# EAGLE design Mainboard (EAGLE 9.2.2)
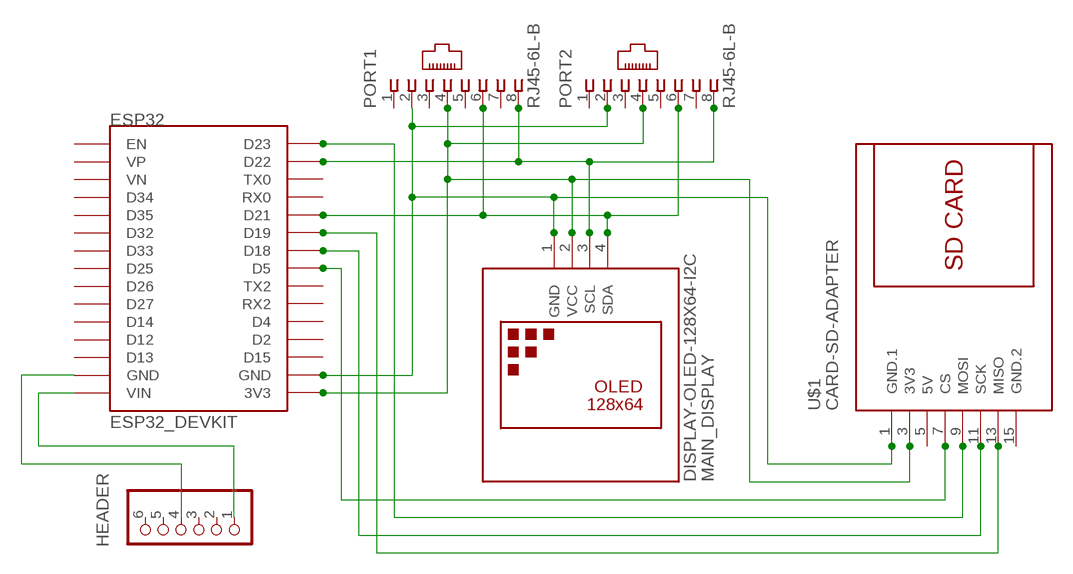
[diagram p0: schematic, sheet 1]

## Parts
ESP32  ESP32_DEVKIT  [ESP32_DEVKIT]
HEADER  PINHD-1X6CLEAN  [1X06-CLEAN]
MAIN_DISPLAY  DISPLAY-OLED-128X64-I2C  [DISPLAY-OLED-128X64-I2C]
PORT1  RJ45-6L-B  [RJ45-NO-SHIELD]
PORT2  RJ45-6L-B  [RJ45-NO-SHIELD]
U$1  CARD-SD-ADAPTER  [CARD-SD-ADAPTER]

## Nets
N$1: ESP32.D21 MAIN_DISPLAY.4(SDA) PORT1.6 PORT2.6
N$2: ESP32.D23 U$1.9(MOSI)
N$3: ESP32.D22 MAIN_DISPLAY.3(SCL) PORT1.8 PORT2.8
N$4: ESP32.D18 U$1.11(SCK)
N$5: ESP32.D5 U$1.7(CS)
N$6: ESP32.D19 U$1.13(MISO)
N$7: ESP32.GND@2(GND) MAIN_DISPLAY.1(GND) PORT1.2 PORT2.2 U$1.1(GND.1)
N$8: ESP32.VIN HEADER.1
N$9: ESP32.3V3 MAIN_DISPLAY.2(VCC) PORT1.4 PORT2.4 U$1.3(3V3)
N$10: ESP32.GND@1(GND) HEADER.4
Unconnected: ESP32.D2 ESP32.D4 ESP32.D12 ESP32.D13 ESP32.D14 ESP32.D15 ESP32.D25 ESP32.D26 ESP32.D27 ESP32.D32 ESP32.D33 ESP32.D34 ESP32.D35 ESP32.EN ESP32.RX0 ESP32.RX2 ESP32.TX0 ESP32.TX2 ESP32.VN ESP32.VP HEADER.2 HEADER.3 HEADER.5 HEADER.6 PORT1.1 PORT1.3 PORT1.5 PORT1.7 PORT2.1 PORT2.3 PORT2.5 PORT2.7

## Power pins joined to a net without a drawn wire
5V: U$1.5(5V)
GND.2: U$1.15(GND.2)

## Library data of the parts
ESP32 = DOIT_ESP32_DEVKIT:ESP32_DEVKIT: ESP32 DEVKIT BOARD
HEADER = adafruit:PINHD-1X6: PIN HEADER
MAIN_DISPLAY = diy-modules:DISPLAY-OLED-128X64-I2C: 128x64 Dot Matrix OLED Module based on SSD1306 chip Variant with I2C interface More details available here: http://www.instructables.com/id/Monochrome-096-i2c-OLED-display-with-arduino-SSD13/ SSD1306 datasheet: https://cdn-shop.adafruit.com/datasheets/SSD1306.pdf Click here to find device on ebay.com <http://www.ebay.com/sch/oled+display+128x64+iic> Note: There are two variants: I2C and SPI. Search for the proper version.
PORT1 = con-tycoelectronics:RJ45: CORCOM Modular RJ Jacks No Shield Source: www.tycoelectronics.com .. ENG_DS_1654001_1099_RJ_L_0507.pdf; MPN: RJ45-6L-B; OC_FARNELL: unknown; OC_NEWARK: 16R6090; SPICEPREFIX: X
PORT2 = con-tycoelectronics:RJ45: CORCOM Modular RJ Jacks No Shield Source: www.tycoelectronics.com .. ENG_DS_1654001_1099_RJ_L_0507.pdf; MPN: RJ45-6L-B; OC_FARNELL: unknown; OC_NEWARK: 16R6090
U$1 = diy-modules:CARD-SD-ADAPTER: Full Size SD Card Adapter Module with onboard 3.3V regulator Guide describing how to use SD card with Arduino is available here: https://www.arduino.cc/en/Reference/SDCardNotes Click here to find device on ebay.com <http://www.ebay.com/sch/sd+card+socket+module>

## Board
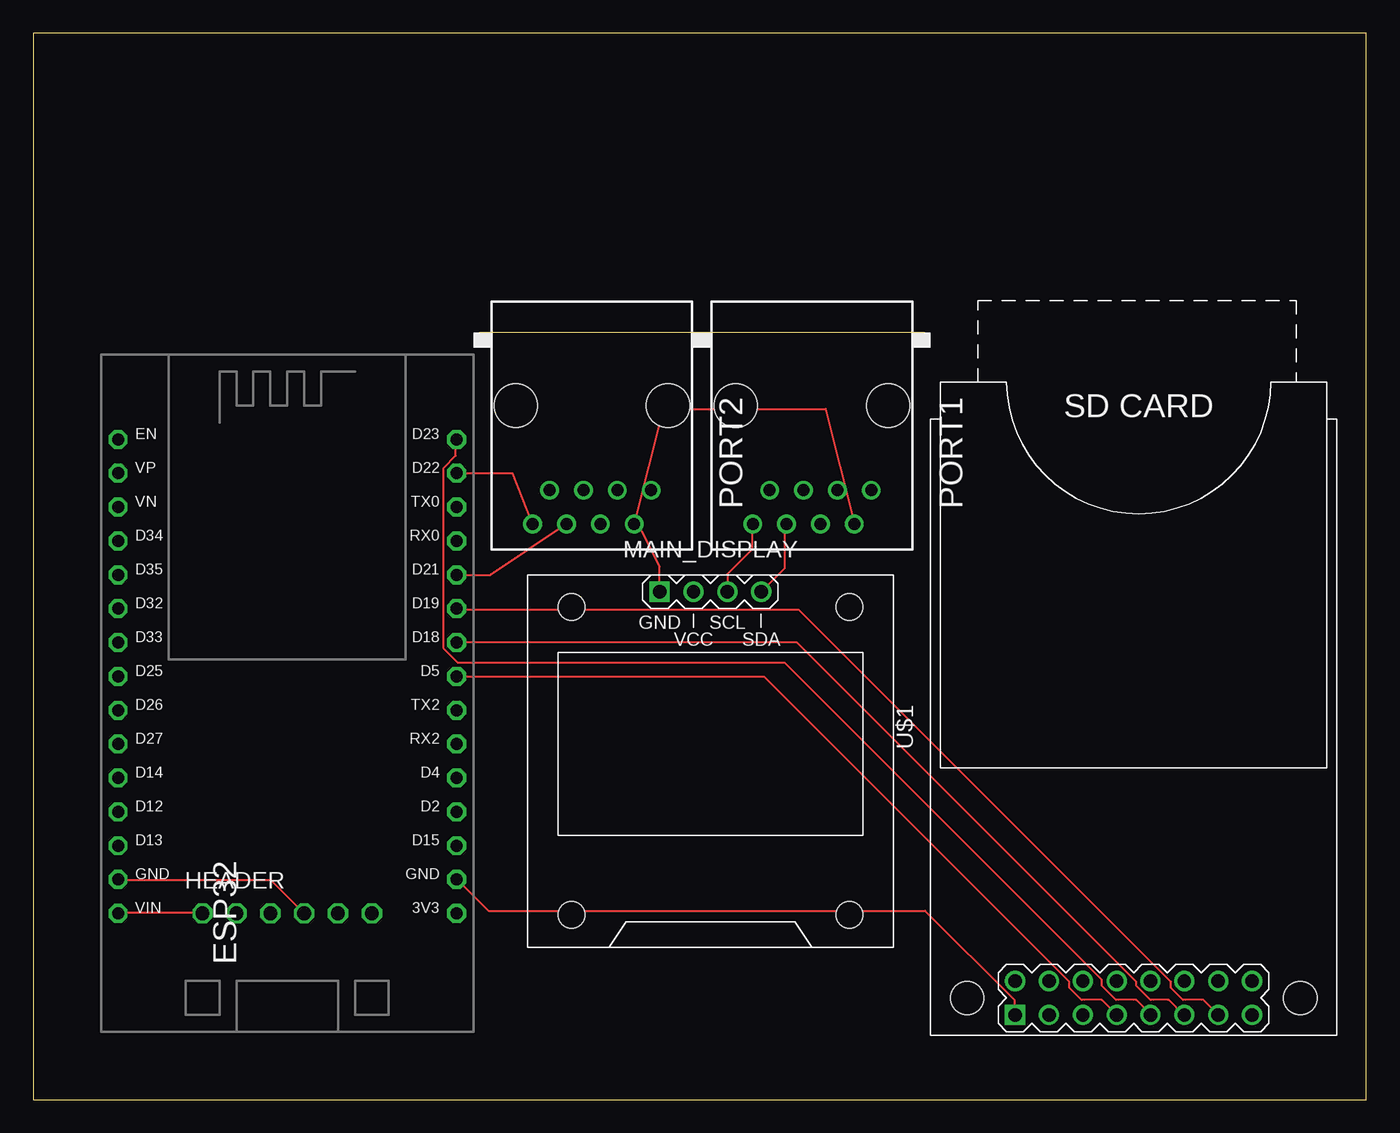
[diagram p1: board, top side]
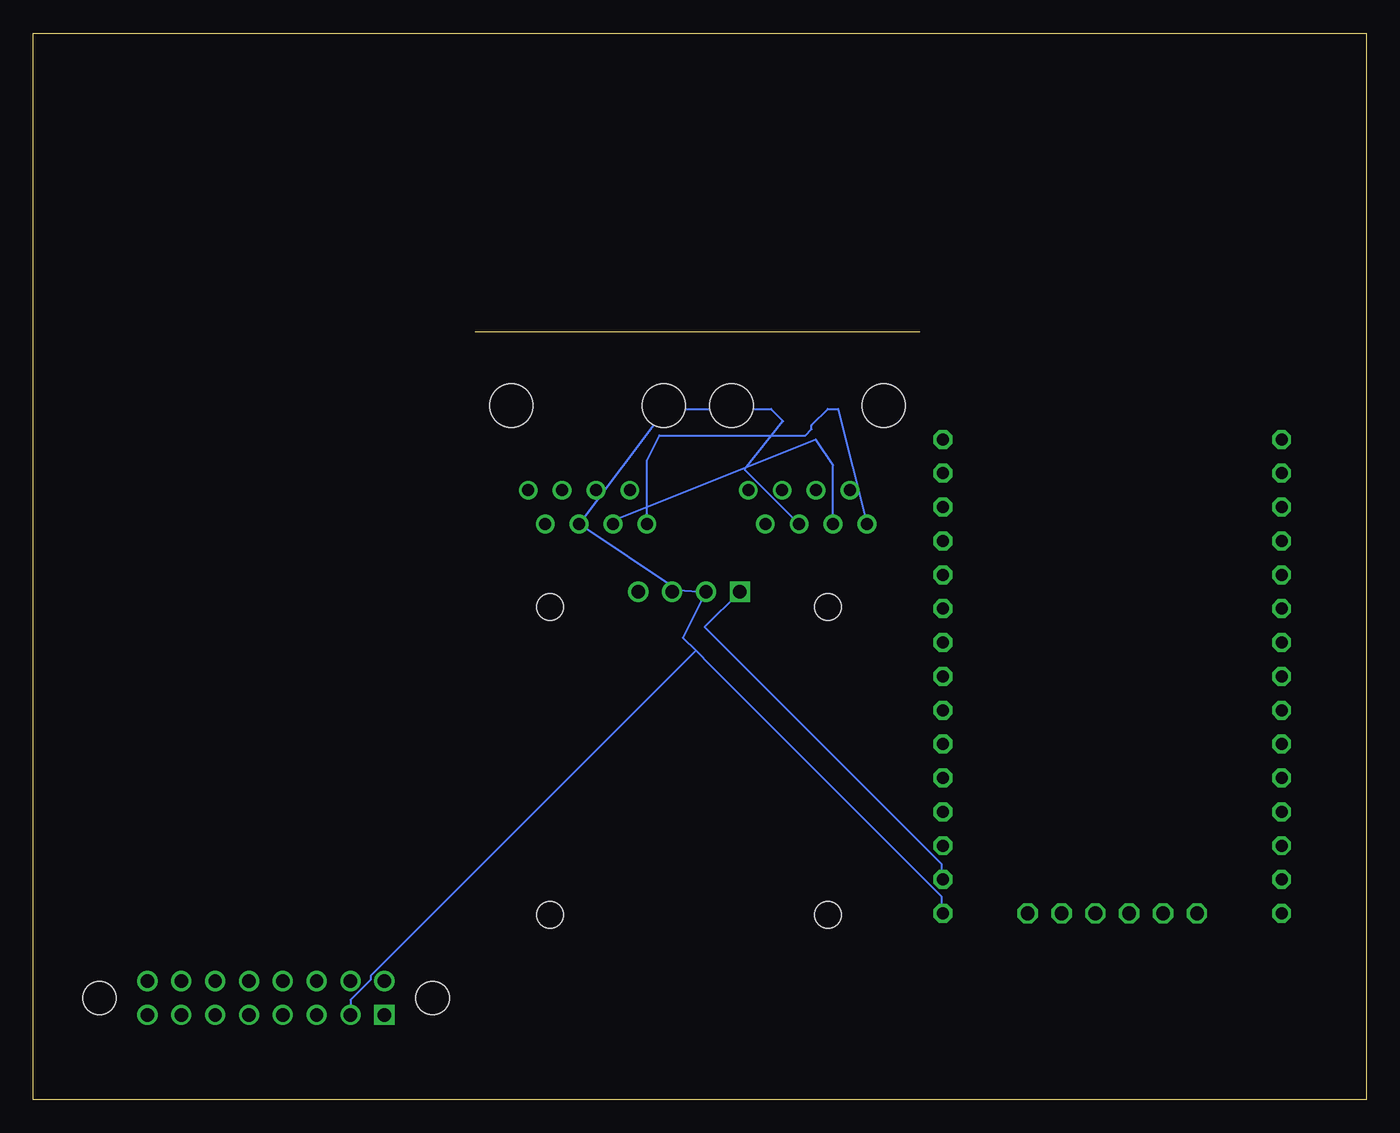
[diagram p2: board, bottom side, seen from below]

Size 100 x 80 mm. Coordinates in mm from the lower left corner, seen from the top.
Outline: 0,0 100,0 100,80 0,80 0,0
Copper layers (1*16): Top 0.035mm / dielectric 1.5mm / Bottom 0.035mm
Design rules "default": minimum track width 6mil, minimum drill 0.35mm, track to track 6mil, track to pad 6mil, pad to pad 6mil, via to via 6mil, smd to smd 6mil, copper to edge 40mil, drill to drill 6mil, minimum pad ring 10mil, minimum via ring 8mil, stop-mask expansion 4mil, vias tented up to drill 0mil, thermal gap 10mil

### Footprints (pad centres in the part's own frame; a part is rotated, then mirrored left to right if it is on the bottom)
ESP32_DEVKIT = drill 0.9 pad 1.422 octagon: 3V3 11.43,-17.78; D2 11.43,-10.16; D4 11.43,-7.62; D5 11.43,0; D12 -13.97,-10.16; D13 -13.97,-12.7; D14 -13.97,-7.62; D15 11.43,-12.7; D18 11.43,2.54; D19 11.43,5.08; D21 11.43,7.62; D22 11.43,15.24; D23 11.43,17.78; D25 -13.97,0; D26 -13.97,-2.54; D27 -13.97,-5.08; D32 -13.97,5.08; D33 -13.97,2.54; D34 -13.97,10.16; D35 -13.97,7.62; EN -13.97,17.78; GND@1 -13.97,-15.24; GND@2 11.43,-15.24; RX0 11.43,10.16; RX2 11.43,-5.08; TX0 11.43,12.7; TX2 11.43,-2.54; VIN -13.97,-17.78; VN -13.97,12.7; VP -13.97,15.24
1X06-CLEAN = drill 1.016 octagon: 1 -6.35,0; 2 -3.81,0; 3 -1.27,0; 4 1.27,0; 5 3.81,0; 6 6.35,0
DISPLAY-OLED-128X64-I2C = drill 1 square: 1 -3.81,12.7 | drill 1: 2 -1.27,12.7; 3 1.27,12.7; 4 3.81,12.7 | hole 2: -10.414,11.557; 10.414,11.557; 10.414,-11.557; -10.414,-11.557
RJ45-NO-SHIELD = drill 0.9 pad 1.4: 1 -4.445,6.35; 2 -3.175,8.89; 3 -1.905,6.35; 4 -0.635,8.89; 5 0.635,6.35; 6 1.905,8.89; 7 3.175,6.35; 8 4.445,8.89 | hole 3.251: -5.715,0; 5.715,0
CARD-SD-ADAPTER = drill 1 square: 1 -21.59,8.89 | drill 1: 2 -19.05,8.89; 3 -21.59,6.35; 4 -19.05,6.35; 5 -21.59,3.81; 6 -19.05,3.81; 7 -21.59,1.27; 8 -19.05,1.27; 9 -21.59,-1.27; 10 -19.05,-1.27; 11 -21.59,-3.81; 12 -19.05,-3.81; 13 -21.59,-6.35; 14 -19.05,-6.35; 15 -21.59,-8.89; 16 -19.05,-8.89 | hole 2.5: -20.32,12.5; -20.32,-12.5

### Placement (x,y rotation side)
ESP32  20.32,31.75 0 top
HEADER  19.05,13.97 0 top
MAIN_DISPLAY  50.8,25.4 0 top
PORT1  58.42,52.07 180 top
PORT2  41.91,52.07 180 top
U$1  82.55,27.94 90 top

### Tracks (layer width: path | path; a pad name or v marks a point on that pad's centre or on a via)
N$1
  Top 0.152: MAIN_DISPLAY.4 56.39,39.88 56.39,43.13 PORT1.6 | PORT2.6 34.29,39.37 ESP32.D21
  Bottom 0.152: PORT1.6 56.08,43.62 41.3,49.53 40.01,47.59 PORT2.6
N$2
  Top 0.152: ESP32.D23 31.7,49.53 31.7,48.31 30.79,47.4 30.79,33.83 31.85,32.77 56.39,32.77 80.16,8.99 80.16,8.53 81.23,7.47 82.75,7.47 83.82,6.4 U$1.9
N$3
  Top 0.152: PORT2.8 35.94,46.99 ESP32.D22 | PORT1.8 53.95,43.13 53.95,41.3 52.07,39.42 MAIN_DISPLAY.3
  Bottom 0.152: PORT2.8 39.62,51.82 40.39,51.82 41.6,50.6 41.6,50.29 42.06,49.84 53.03,49.84 53.98,47.95 PORT1.8
N$4
  Top 0.152: ESP32.D18 57.3,34.29 82.75,8.84 82.75,8.53 83.82,7.47 85.19,7.47 86.26,6.4 U$1.11
N$5
  Top 0.152: U$1.7 80.16,7.47 78.64,7.47 77.72,8.38 77.72,8.84 54.86,31.7 31.85,31.7 ESP32.D5
N$6
  Top 0.152: U$1.13 87.78,7.47 86.26,7.47 85.34,8.38 85.34,8.84 57.45,36.73 31.85,36.73 ESP32.D19
N$7
  Top 0.152: MAIN_DISPLAY.1 46.99,39.98 45.7,42.57 PORT2.2 47.24,51.82 59.44,51.82 PORT1.2 | U$1.1 73.61,6.4 73.61,7.47 66.9,14.17 34.14,14.17 31.85,16.46 ESP32.GND@2
  Bottom 0.152: ESP32.GND@2 31.85,16.61 31.85,17.68 49.63,35.46 MAIN_DISPLAY.1
N$8
  Top 0.152: ESP32.VIN 6.4,14.02 12.65,14.02 HEADER.1
N$9
  Bottom 0.152: PORT2.4 46.64,47.27 43.74,50.9 44.65,51.82 52.58,51.82 PORT1.4 51.66,38.25 MAIN_DISPLAY.2 51.26,34.65 50.29,33.68 | 50.29,33.68 49.14,32.53 31.85,15.24 31.85,14.02 ESP32.3V3 | U$1.3 76.2,7.47 74.68,8.99 74.68,9.3 50.29,33.68
N$10
  Top 0.152: HEADER.4 17.83,16.46 6.4,16.46 ESP32.GND@1